# Altium schematic sheet Sheet1.SchDoc
size A4; SheetNumber: 1; SheetTotal: 1
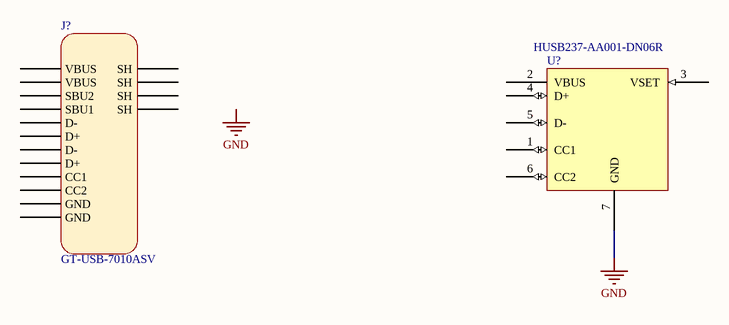
[diagram p0: Sheet1.SchDoc]

## Parts
J?  GT-USB-7010ASV  [CONN_CH_USB_SMD_USB]
U?  Manufacture Part no: HUSB237-AA001-DN06R  (hidden comment: USB PDC)

## Nets
GND: U?.7(GND)

Not connected (* = marked no-connect by the designer): J? 1(VBUS) 2(VBUS) 3(SBU2) 4(CC1) 5(D-) 6(D+) 7(D-) 8(D+) 9(SBU1) 10(CC2) 11(GND) 12(GND) 13(SH) 14(SH) 15(SH) 16(SH); U? 1(CC1) 2(VBUS) 3(VSET) 4(D+) 5(D-) 6(CC2)

## Notes on the sheet
- Labels drawn without touching a wire or pin: GND

## Library data of the parts
J? = Connector USB-C CH: USB 2.0 1 16P -40℃~+85℃ Type-C SMD USB, DVI, HDMI Connector Assemblies ROHS; Manufacturer 1: G-Switch; Designator: J?; Manufacturer Part Number 1: GT-USB-7010ASV; Quantity: *; ComponentLink1Description: Datasheet; ComponentLink1URL: https://atta.szlcsc.com/upload/public/pdf/source/20230327/DF227B64686AC8FA0AD1775797F2C3F1.pdf; ComponentLink2Description: Product Link; ComponentLink2URL: https://www.lcsc.com/product-detail/C2988369.html; Distributor: LCSC; LCSC Part Number: C2988369; Package: SMD
U? = USB PDC: / Power Receiver Controller 100W DFN-6L-EP(2x2) Power Management - Specialized RoHS; Manufacture: Hynetek; ComponentLink1Description: Datasheet; ComponentLink1URL: https://www.lcsc.com/datasheet/C22373734.pdf?spm=wm.sxq.inf.ggs&lcsc_vid=TgVXBQIERVhWAQVWQFRfUlMCQQcPBlQFRABYU1YDE1cxVlNRQVhcUlBVR1VZVjsOAxUeFF5JWBYZEEoKFBINSQcJGk4dAgUUFAk%3D; ComponentLink2Description: Product Link; ComponentLink2URL: https://www.lcsc.com/product-detail/C22373734.html; LCSC Part: C22373734